# Altium schematic sheet Programmer-JTAG.SchDoc
size A
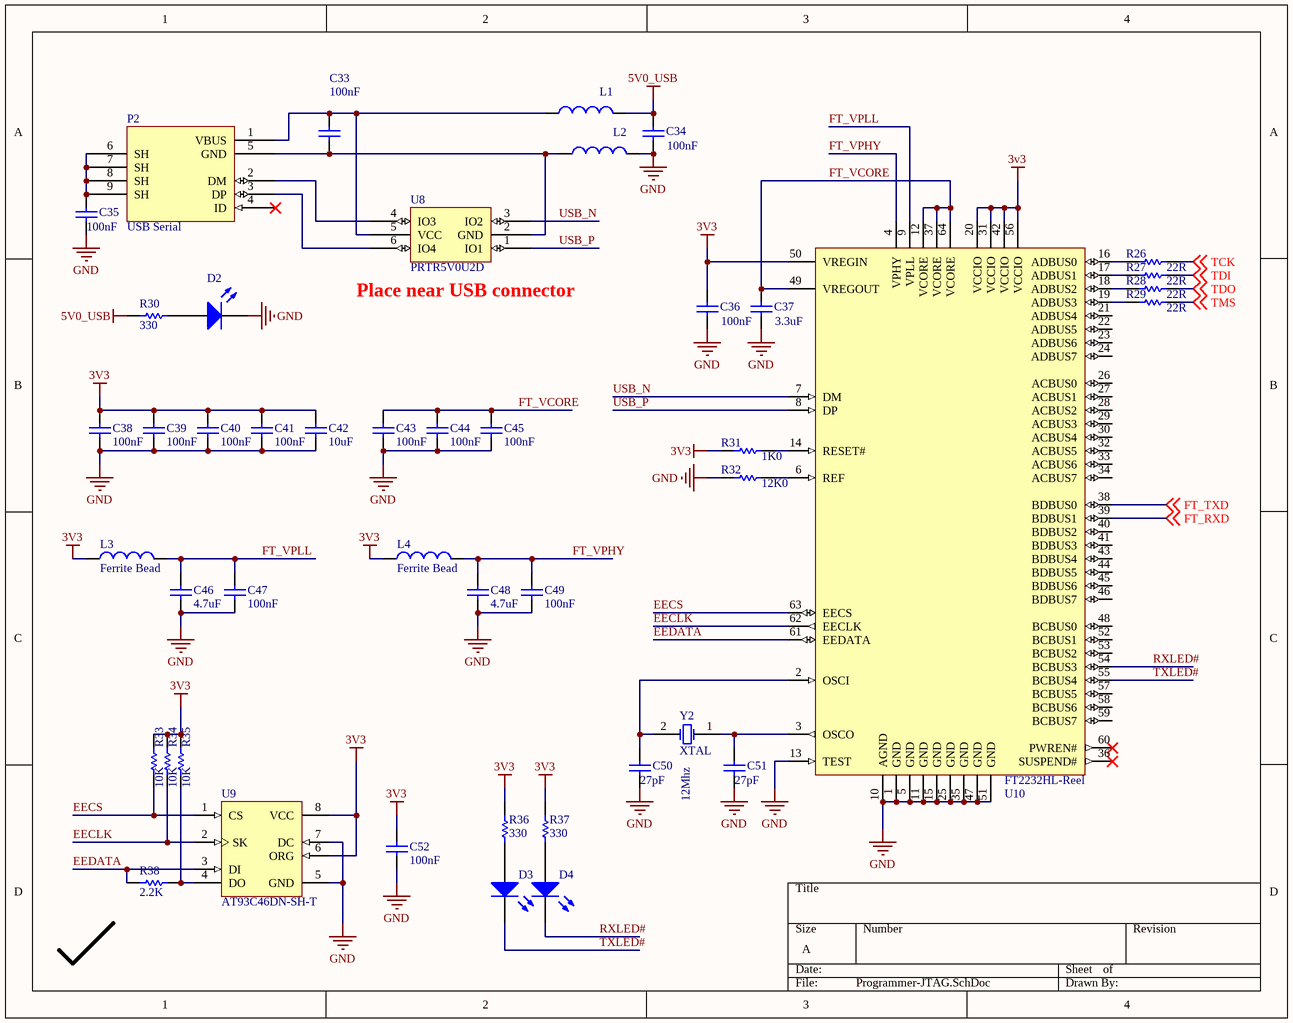
[diagram p0: Programmer-JTAG.SchDoc]

## Parts
C33  value 100nF  [C0805]  (hidden comment: Cap)
C34  value 100nF  [C0805]  (hidden comment: Cap)
C35  value 100nF  [C0805]  (hidden comment: Cap)
C36  value 100nF  [0603PKG]  (hidden comment: Cap)
C37  value 3.3uF  [C0805]  (hidden comment: Cap)
C38  value 100nF  [0603PKG]  (hidden comment: Cap Semi)
C39  value 100nF  [0603PKG]  (hidden comment: Cap Semi)
C40  value 100nF  [0603PKG]  (hidden comment: Cap Semi)
C41  value 100nF  [0603PKG]  (hidden comment: Cap Semi)
C42  value 10uF  [0603PKG]  (hidden comment: Cap Semi)
C43  value 100nF  [0603PKG]  (hidden comment: Cap Semi)
C44  value 100nF  [0603PKG]  (hidden comment: Cap Semi)
C45  value 100nF  [0603PKG]  (hidden comment: Cap Semi)
C46  value 4.7uF  [0603PKG]  (hidden comment: Cap Semi)
C47  value 100nF  [0603PKG]  (hidden comment: Cap Semi)
C48  value 4.7uF  [0603PKG]  (hidden comment: Cap Semi)
C49  value 100nF  [0603PKG]  (hidden comment: Cap Semi)
C50  value 27pF  [0603PKG]  (hidden comment: Cap)
C51  value 27pF  [0603PKG]  (hidden comment: Cap)
C52  value 100nF  [0603PKG]  (hidden comment: Cap Semi)
D2  LED0  [C0805]  (value not drawn)
D3  LED0  [C0805]  (value not drawn)
D4  LED0  [C0805]  (value not drawn)
L1  Ferrite Bead  [C0805]  (value not drawn)
L2  Ferrite Bead  [C0805]  (value not drawn)
L3  Ferrite Bead  [C0805]
L4  Ferrite Bead  [C0805]
P2  USB Serial  [Mini USB]
R26  value 22R  [0603PKG]  (hidden comment: Res Semi)
R27  value 22R  [0603PKG]  (hidden comment: Res Semi)
R28  value 22R  [0603PKG]  (hidden comment: Res Semi)
R29  value 22R  [0603PKG]  (hidden comment: Res Semi)
R30  value 330  [0603PKG]  (hidden comment: Res Semi)
R31  value 1K0  [0603PKG]  (hidden comment: Res Semi)
R32  value 12K0  [0603PKG]  (hidden comment: Res Semi)
R33  value 10K  [0603PKG]  (hidden comment: Res Semi)
R34  value 10K  [0603PKG]  (hidden comment: Res Semi)
R35  value 10K  [0603PKG]  (hidden comment: Res Semi)
R36  value 330  [0603PKG]  (hidden comment: Res Semi)
R37  value 330  [0603PKG]  (hidden comment: Res Semi)
R38  value 2.2K  [0603PKG]  (hidden comment: Res Semi)
U8  PRTR5V0U2D  [SOT457]
U9  AT93C46DN-SH-T  [8S1_N]
U10  FT2232HL-Reel  [LQFP-64_N]
Y2  XTAL  value 12Mhz  [SMD_Crystal]

## Nets
3v3: C36.2 C38.2 C39.2 C40.2 C41.2 C42.2 C52.2 L3.1 L4.1 R31.2 R33.1 R34.1 R35.1 R36.2 R37.2 U9.6(ORG) U9.8(VCC) U10.20(VCCIO) U10.31(VCCIO) U10.42(VCCIO) U10.50(VREGIN) U10.56(VCCIO)
5V0_USB: C34.2 L1.2 R30.2
GND: C34.1 C35.1 C36.1 C37.1 C38.1 C39.1 C40.1 C41.1 C42.1 C43.1 C44.1 C45.1 C46.1 C47.1 C48.1 C49.1 C50.1 C51.1 C52.1 D2.2(K) L2.2 R32.2 U9.5(GND) U9.7(DC) U10.1(GND) U10.5(GND) U10.10(AGND) U10.11(GND) U10.13(TEST) U10.15(GND) U10.25(GND) U10.35(GND) U10.47(GND) U10.51(GND)
EECLK: R34.2 U9.2(SK) U10.62(EECLK)
EECS: R33.2 U9.1(CS) U10.63(EECS)
EEDATA: R38.2 U9.3(DI) U10.61(EEDATA)
FT_RXD: U10.39(BDBUS1) ; off-sheet FT_RXD
FT_TXD: U10.38(BDBUS0) ; off-sheet FT_TXD
FT_VCORE: C37.2 C43.2 C44.2 C45.2 U10.12(VCORE) U10.37(VCORE) U10.49(VREGOUT) U10.64(VCORE)
FT_VPHY: C48.2 C49.2 L4.2 U10.4(VPHY)
FT_VPLL: C46.2 C47.2 L3.2 U10.9(VPLL)
RXLED#: D4.2(K) U10.54(BCBUS3)
TCK: R26.1 ; off-sheet TCK
TDI: R27.1 ; off-sheet TDI
TDO: R28.1 ; off-sheet TDO
TMS: R29.1 ; off-sheet TMS
TXLED#: D3.2(K) U10.55(BCBUS4)
USB_N: U8.3(IO2) U10.7(DM)
USB_P: U8.1(IO1) U10.8(DP)
NetC33_1: C33.1 L2.1 P2.5(GND) U8.2(GND)
NetC33_2: C33.2 L1.1 P2.1(VBUS) U8.5(VCC)
NetC35_2: C35.2 P2.6(SH) P2.7(SH) P2.8(SH) P2.9(SH)
NetC50_2: C50.2 U10.2(OSCI) Y2.2(OSC2)
NetC51_2: C51.2 U10.3(OSCO) Y2.1(OSC1)
NetD2_1: D2.1(A) R30.1
NetD3_1: D3.1(A) R36.1
NetD4_1: D4.1(A) R37.1
NetP2_2: P2.2(DM) U8.4(IO3)
NetP2_3: P2.3(DP) U8.6(IO4)
NetR26_2: R26.2 U10.16(ADBUS0)
NetR27_2: R27.2 U10.17(ADBUS1)
NetR28_2: R28.2 U10.18(ADBUS2)
NetR29_2: R29.2 U10.19(ADBUS3)
NetR31_1: R31.1 U10.14(RESET#)
NetR32_1: R32.1 U10.6(REF)
NetR35_2: R35.2 R38.1 U9.4(DO)

Not connected (* = marked no-connect by the designer): P2 4(ID)*; U10 21(ADBUS4) 22(ADBUS5) 23(ADBUS6) 24(ADBUS7) 26(ACBUS0) 27(ACBUS1) 28(ACBUS2) 29(ACBUS3) 30(ACBUS4) 32(ACBUS5) 33(ACBUS6) 34(ACBUS7) 36(SUSPEND#)* 40(BDBUS2) 41(BDBUS3) 43(BDBUS4) 44(BDBUS5) 45(BDBUS6) 46(BDBUS7) 48(BCBUS0) 52(BCBUS1) 53(BCBUS2) 57(BCBUS5) 58(BCBUS6) 59(BCBUS7) 60(PWREN#)*

## Notes on the sheet
- (near U8) Place near USB connector

## Library data of the parts
C33-C37 C50 C51 = Cap: Capacitor; Published: 8-Jun-2000; LatestRevisionDate: 17-Jul-2002; LatestRevisionNote: Re-released for DXP Platform.; PackageReference: RAD-0.3; Publisher: Altium Limited; PackageDescription: Radial Cap, Thru-Hole; 2 Leads; 0.3 in Pin Spacing
C38-C49 C52 = Cap Semi: Capacitor (Semiconductor SIM Model); Published: 8-Jun-2000; LatestRevisionDate: 29-May-2009; LatestRevisionNote: IPC-7351 Footprint Added.; PackageReference: C1206; Publisher: Altium Limited; PackageDescription: Chip Capacitor
D2-D4 = LED0: Typical INFRARED GaAs LED; Published: 8-Jun-2000; LatestRevisionDate: 08-Jul-2005; LatestRevisionNote: Mech Layer 1 removed.; PackageReference: LED-0; Publisher: Altium Limited; PackageDescription: LED; 2 Leads
L1-L4 = Inductor: Code_IEC: 1005; Value: 10mH; Published: 8-Jun-2000; LatestRevisionDate: 29-May-2009; LatestRevisionNote: IPC-7351 Footprint Added.; PackageReference: 0402-A; Publisher: Altium Limited; PackageDescription: Chip Inductor; Code_JEITA: 0402
P2 = Mini USB
R26-R38 = Res Semi: Semiconductor Resistor; Published: 8-Jun-2000; LatestRevisionDate: 17-Jul-2002; LatestRevisionNote: Re-released for DXP Platform.; PackageReference: AXIAL-0.5; Publisher: Altium Limited; PackageDescription: Axial Device, Thru-Hole; 2 Leads; 0.5 in Pin Spacing
U8 = PRTR5V0U2D: TVS Zener
U9 = AT93C46DN-SP25-B: 1Kbit (128 x 8 or 64 x 16), 3-wire Bus Serial Automotive EEPROM, 2.5V, 8-Pin SOIC, Bulk; DatasheetVersion: 8674B,  Oct-2009; PackageVersion: revC, Mar-2005; PackageReference: 8S1; PackageDescription: 8-Lead (0.150" Wide Body), Plastic Gull Wing Small Outline (JEDEC SOIC); Code_JEDEC: MS-012-AA; Code_IPC: SOIC127P600-8; ComponentLink1Description: Manufacturer URL; ComponentLink1URL: http://www.atmel.com/; ComponentLink2Description: Datasheet; ComponentLink2URL: http://www.atmel.com/dyn/resources/prod_documents/doc8674.pdf
U10 = FT2232HL-Reel: Dual High Speed USB To Multipurpose UART/FIFO IC, 64-pin LQFP, Tape and Reel; Manufacturer: FTDI; DatasheetVersion: ver 2.21, Jun-2012; PackageVersion: Jun-12; PackageReference: LQFP-64; PackageDescription: 64-Pin Thin Quad Flat Pack, 10 x 10 x 1.4 mm Body, 0.5 mm Pitch; PartNumber: FT2232HL-Reel; ComponentLink1Description: Manufacturer URL; ComponentLink1URL: http://www.ftdichip.com/; ComponentLink2Description: Datasheet; ComponentLink2URL: http://www.ftdichip.com/Support/Documents/DataSheets/ICs/DS_FT2232H.pdf
Y2 = XTAL: Crystal Oscillator; Published: 8-Jun-2000; LatestRevisionDate: 17-Jul-2002; LatestRevisionNote: Re-released for DXP Platform.; PackageReference: R38; Publisher: Altium Limited; PackageDescription: Crystal, Thru-Hole; 2 Leads; Body 3.1 x 8.2 mm (Dia.xH)